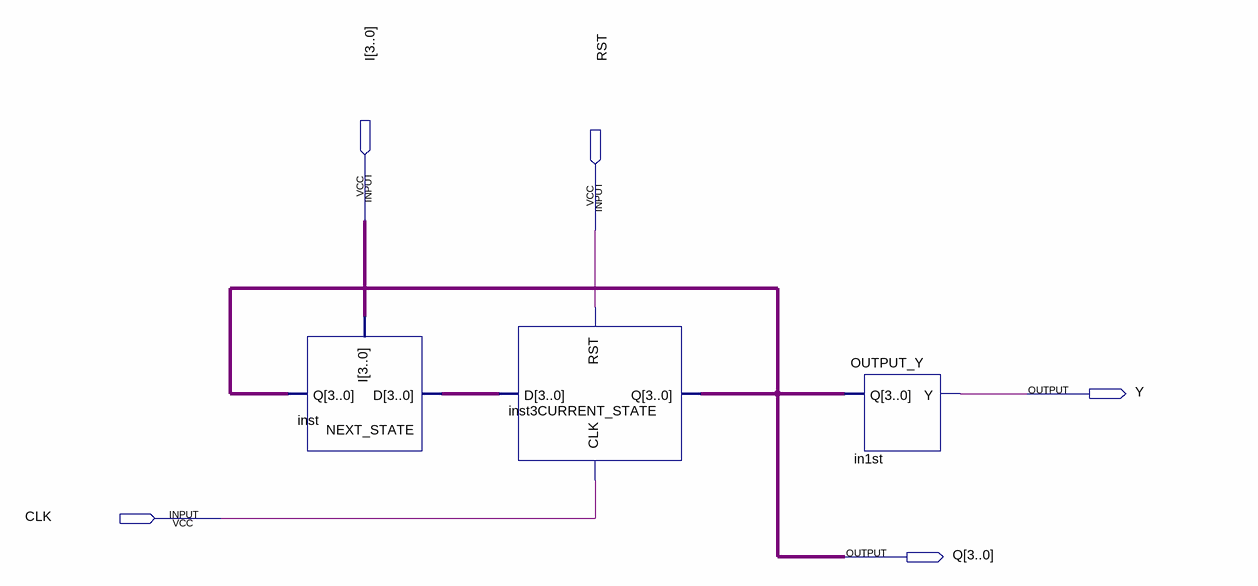
[diagram p0: schematic sheet]
// Quartus schematic MSSV.bdf as structural Verilog: 3 symbols, 5 pins
module MSSV (
  input  [3:0] I,
  input  RST,
  input  CLK,
  output Y,
  output [3:0] Q
);

  wire [3:0] inst_d;

  NEXT_STATE inst (.I(I), .Q(Q), .D(inst_d));
  CURRENT_STATE inst3 (.D(inst_d), .CLK(CLK), .RST(RST), .Q(Q));
  OUTPUT_Y in1st (.Q(Q), .Y(Y));
endmodule
